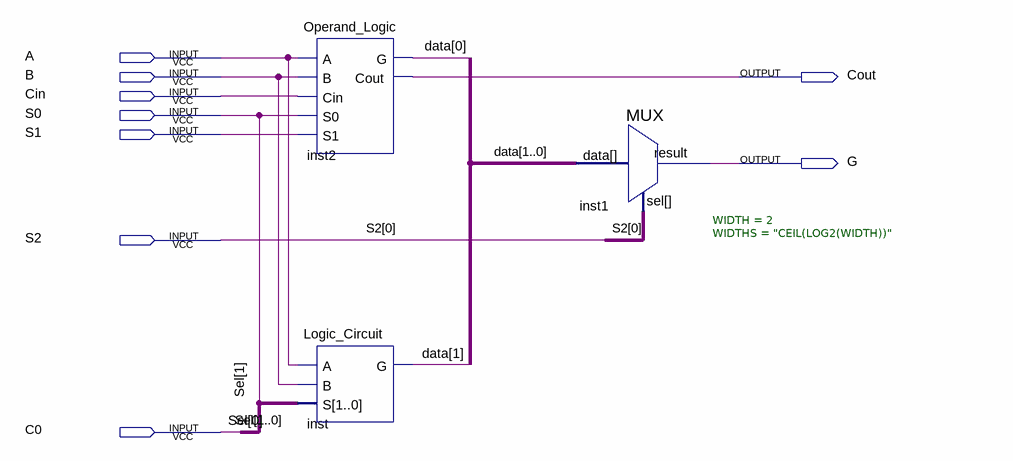
[diagram p0: schematic sheet]
// Quartus schematic ALU1.bdf as structural Verilog: 3 symbols, 9 pins
module ALU1 (
  input  A,
  input  B,
  input  Cin,
  input  S0,
  input  S1,
  input  S2,
  input  C0,
  output Cout,
  output G
);

  wire [1:0] data;

  Operand_Logic inst2 (.A(A), .B(B), .S1(S1), .S0(S0), .Cin(Cin), .G(data[0]), .Cout(Cout));
  Logic_Circuit inst (.A(A), .B(B), .S({S0, C0}), .G(data[1]));
  MUX #(.WIDTH(2), .WIDTHS("CEIL(LOG2(WIDTH))")) inst1 (.data(data), .sel(S2), .result(G));

  // Other names for the same wires on the sheet: Sel[1:0] = {S0, C0}; S2[0] = S2
endmodule
